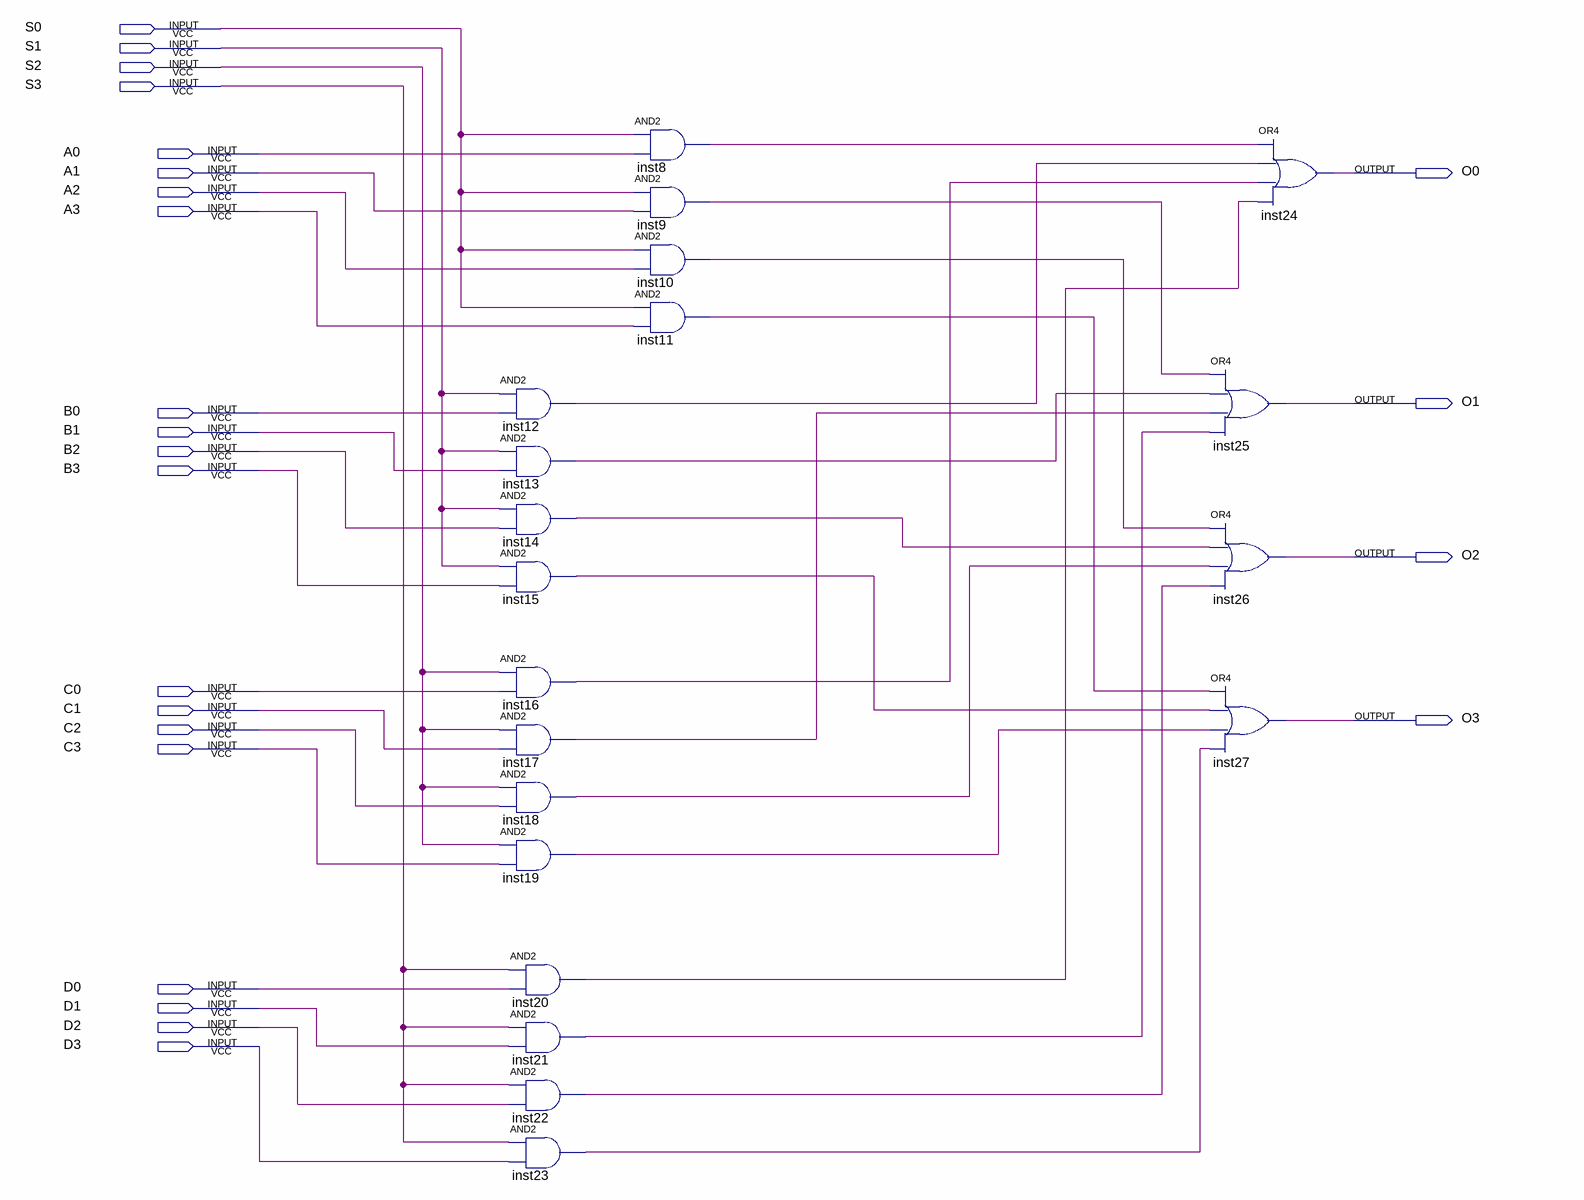
[diagram p0: schematic sheet]
// Quartus schematic selector_16bits.bdf as structural Verilog: 20 symbols, 24 pins
module selector_16bits (
  input  S0,
  input  S1,
  input  S2,
  input  S3,
  input  A0,
  input  A1,
  input  A2,
  input  A3,
  input  B0,
  input  B1,
  input  B2,
  input  B3,
  input  C0,
  input  C1,
  input  C2,
  input  C3,
  input  D0,
  input  D1,
  input  D2,
  input  D3,
  output O0,
  output O1,
  output O2,
  output O3
);

  wire inst8_out, inst9_out, inst10_out, inst11_out, inst12_out, inst13_out, inst14_out, inst15_out,
       inst16_out, inst17_out, inst18_out, inst19_out, inst20_out, inst21_out, inst22_out, inst23_out;

  and inst12 (inst12_out, S1, B0);
  and inst13 (inst13_out, S1, B1);
  and inst14 (inst14_out, S1, B2);
  and inst15 (inst15_out, S1, B3);
  and inst16 (inst16_out, S2, C0);
  and inst17 (inst17_out, S2, C1);
  and inst18 (inst18_out, S2, C2);
  and inst19 (inst19_out, S2, C3);
  and inst20 (inst20_out, S3, D0);
  and inst21 (inst21_out, S3, D1);
  and inst22 (inst22_out, S3, D2);
  and inst23 (inst23_out, S3, D3);
  and inst8 (inst8_out, S0, A0);
  and inst9 (inst9_out, S0, A1);
  and inst10 (inst10_out, S0, A2);
  and inst11 (inst11_out, S0, A3);
  or inst24 (O0, inst8_out, inst12_out, inst16_out, inst20_out);
  or inst25 (O1, inst9_out, inst13_out, inst17_out, inst21_out);
  or inst26 (O2, inst10_out, inst14_out, inst18_out, inst22_out);
  or inst27 (O3, inst11_out, inst15_out, inst19_out, inst23_out);
endmodule
